# Altium schematic sheet RTL8201F.SchDoc
size A3; Author: Nguyễn Hữu Thắng; DrawnBy: Nguyễn Hữu Thắng; SheetNumber: 31; SheetTotal: 35
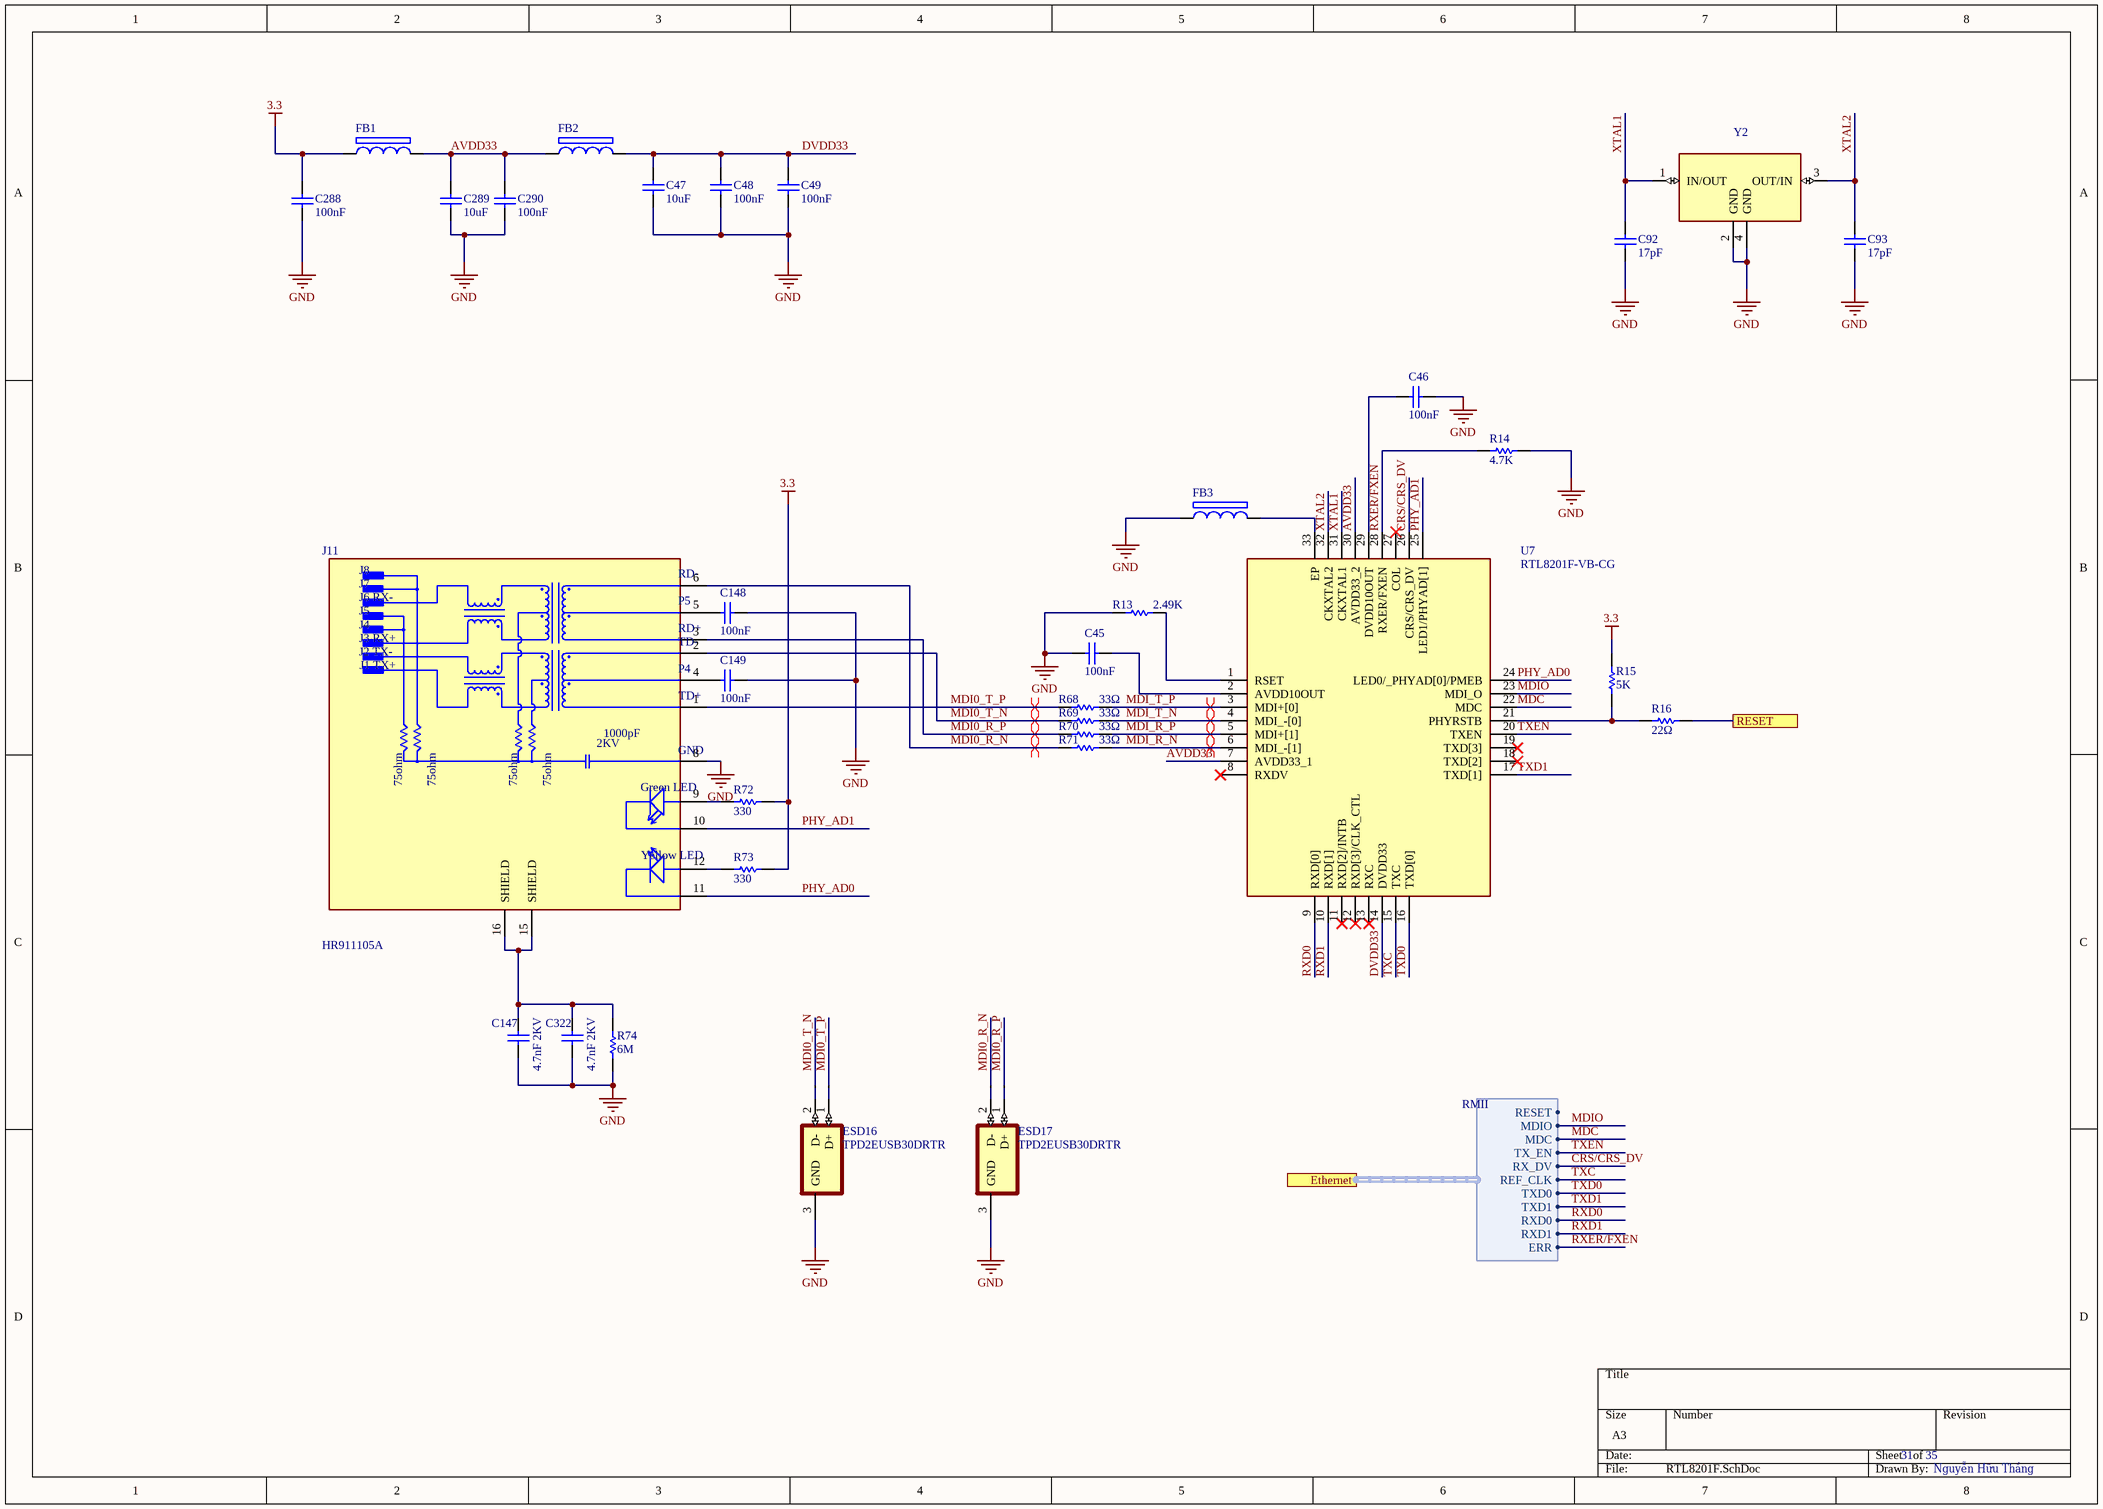
[diagram p0: RTL8201F.SchDoc]

## Parts
.10  P  [P]  (value not drawn)
.12  P  [P]  (value not drawn)
.15  P  [P]  (value not drawn)
.16  P  [P]  (value not drawn)
C45  value 100nF  [C0603]  (hidden comment: C0603)
C46  value 100nF  [C0603]  (hidden comment: C0603)
C47  value 10uF  [C1210]  (hidden comment: C1210)
C48  value 100nF  [C0603]  (hidden comment: C0603)
C49  value 100nF  [C0603]  (hidden comment: C0603)
C92  value 17pF  [C0402]  (hidden comment: C0402)
C93  value 17pF  [C0402]  (hidden comment: C0402)
C147  value 4.7nF 2KV  [C1210]  (hidden comment: C1210)
C148  value 100nF  [C0603]  (hidden comment: C0603)
C149  value 100nF  [C0603]  (hidden comment: C0603)
C288  value 100nF  [C0603]  (hidden comment: C0603)
C289  value 10uF  [C1210]  (hidden comment: C1210)
C290  value 100nF  [C0603]  (hidden comment: C0603)
C322  value 4.7nF 2KV  [C1210]  (hidden comment: C1210)
ESD16  TPD2EUSB30DRTR  [SOTFL35P100X50-3N]
ESD17  TPD2EUSB30DRTR  [SOTFL35P100X50-3N]
FB1  BLM18KG121TN1D  [BLM18EG101TH1D]  (value not drawn)
FB2  BLM18KG121TN1D  [BLM18EG101TH1D]  (value not drawn)
FB3  BLM18KG121TN1D  [BLM18EG101TH1D]  (value not drawn)
J11  HR911105A  [HANRUN_HR911105A]
R13  value 2.49K  [R0603]  (hidden comment: R0603)
R14  value 4.7K  [R0603]  (hidden comment: R0603)
R15  value 5K  [R0603]  (hidden comment: R0603)
R16  value 22Ω  [R0603]  (hidden comment: R0603)
R68  value 33Ω  [R0603]  (hidden comment: R0603)
R69  value 33Ω  [R0603]  (hidden comment: R0603)
R70  value 33Ω  [R0603]  (hidden comment: R0603)
R71  value 33Ω  [R0603]  (hidden comment: R0603)
R72  value 330  [R0603]  (hidden comment: R0603)
R73  value 330  [R0603]  (hidden comment: R0603)
R74  value 6M  [R0603]  (hidden comment: R0603)
U7  RTL8201F-VB-CG  [RTL8201F]
Y2  LGE25.000M  [XTAL_ECS-250-6-33B2-CTN-TR3]  (value not drawn)

## Ports
Ethernet (harness RMII, see main[7600,8000], MT8365[6000,9000], MT8365_CONN[13494.004,8500]), RESET (see main[8200,8000], Control_Interface[4100,4800], Power[11300,7100], UART[1500,3000])

## Harnesses
RMII: MDIO, MDC, TX_EN, RX_DV, REF_CLK, TXD0, TXD1, RXD0, RXD1, RESET, ERR

## Nets
3.3: C288.2 FB1.1 R15.2 R72.2 R73.2
GND: C45.2 C46.1 C47.1 C48.1 C49.1 C92.1 C93.1 C147.1 C148.1 C149.1 C288.1 C289.1 C290.1 C322.1 ESD16.3(GND) ESD17.3(GND) FB3.1 J11.8(GND) R13.1 R14.2 R74.2 Y2.2(GND) Y2.4(GND)
AVDD33: C289.2 C290.2 FB1.2 FB2.1 U7.7(AVDD33_1) U7.30(AVDD33_2)
CRS/CRS_DV: U7.26(CRS/CRS_DV) ; port Ethernet.RX_DV
DVDD33: C47.2 C48.2 C49.2 FB2.2 U7.14(DVDD33)
MDC: U7.22(MDC) ; port Ethernet.MDC
MDI0_R_N: .15.2 J11.6(RD-) R71.1
MDI0_R_P: .16.2 J11.3(RD+) R70.1
MDI0_T_N: .10.2 J11.2(TD-) R69.1
MDI0_T_P: .12.2 J11.1(TD+) R68.1
MDI_R_N: R71.2 U7.6(MDI_-[1])
MDI_R_P: R70.2 U7.5(MDI+[1])
MDI_T_N: R69.2 U7.4(MDI_-[0])
MDI_T_P: R68.2 U7.3(MDI+[0])
MDIO: U7.23(MDI_O) ; port Ethernet.MDIO
PHY_AD0: J11.11(YC) U7.24(LED0/_PHYAD[0]/PMEB)
PHY_AD1: J11.10(GC) U7.25(LED1/PHYAD[1])
RESET: R16.2 ; port RESET
RXD0: U7.9(RXD[0]) ; port Ethernet.RXD0
RXD1: U7.10(RXD[1]) ; port Ethernet.RXD1
RXER/FXEN: R14.1 U7.28(RXER/FXEN) ; port Ethernet.ERR
TXC: U7.15(TXC) ; port Ethernet.REF_CLK
TXD0: U7.16(TXD[0]) ; port Ethernet.TXD0
TXD1: U7.17(TXD[1]) ; port Ethernet.TXD1
TXEN: U7.20(TXEN) ; port Ethernet.TX_EN
XTAL1: C92.2 U7.31(CKXTAL1) Y2.1(IN/OUT)
XTAL2: C93.2 U7.32(CKXTAL2) Y2.3(OUT/IN)
Net.10_1: .10.1 ESD16.2(D-)
Net.12_1: .12.1 ESD16.1(D+)
Net.15_1: .15.1 ESD17.2(D-)
Net.16_1: .16.1 ESD17.1(D+)
NetC45_1: C45.1 U7.2(AVDD10OUT)
NetC46_2: C46.2 U7.29(DVDD10OUT)
NetC147_2: C147.2 C322.2 J11.15(SHIELD) J11.16(SHIELD) R74.1
NetC148_2: C148.2 J11.5(P5)
NetC149_2: C149.2 J11.4(P4)
NetFB3_2: FB3.2 U7.33(EP)
NetJ11_9: J11.9(GA) R72.1
NetJ11_12: J11.12(YA) R73.1
NetR13_2: R13.2 U7.1(RSET)
NetR15_1: R15.1 R16.1 U7.21(PHYRSTB)

Not connected (* = marked no-connect by the designer): U7 8(RXDV)* 11(RXD[2]/INTB)* 12(RXD[3]/CLK_CTL)* 13(RXC)* 18(TXD[2])* 19(TXD[3])* 27(COL)*

## Layout directives
differential pair: MDI0_R_N, MDI0_R_P, MDI0_T_N, MDI0_T_P, MDI_R_N, MDI_R_P, MDI_T_N, MDI_T_P

## Notes on the sheet
- (in symbol HR911105A) J8; J7; J6 RX-; J5; J4; J3 RX+; J2 TX-; J1 TX+; 1000pF; 75ohm; 2KV; Green LED; Yellow LED

## Library data of the parts
C92 C93 = C0402: nên chọn tụ từ 14 đến 20 với LGE25.000M
ESD16 ESD17 = TPD2EUSB30DRTR: 2-channel ESD solution for SuperSpeed USB 3.0 interface 3-SOT-9X3 -40 to 85
FB1-FB3 = BLM18KG121TN1D: Ferrite Bead. 0603. 3A.  DC Resistance(DCR) 30mΩ. 120Ω@100MHz; Manufacturer_Name: Murata Electronics; Datasheet Link: http://www.murata.com/~/media/webrenewal/support/library/catalog/products/emc/emifil/c31e.ashx?la=en-gb; Height: 0.75mm; Manufacturer_Part_Number: BLM18KG121TN1D; Mouser Part Number: 81-BLM18KG121TN1D; Mouser Price/Stock: https://www.mouser.co.uk/ProductDetail/Murata-Electronics/BLM18KG121TN1D?qs=rvfpa0%252BU10PYAwVv0fw24Q%3D%3D; Arrow Part Number: BLM18KG121TN1D; Arrow Price/Stock: https://www.arrow.com/en/products/blm18kg121tn1d/murata-manufacturing?utm_currency=USD&region=nac
J11 = HR911105A: RJ45 có biến áp
U7 = RTL8201F-VB-CG: Integrated Circuit; Manufacturer_Name: Realtek; Datasheet Link: https://pdf1.alldatasheet.com/datasheet-pdf/view/1132250/REALTEK/RTL8201F-VB-CG.html; Height: 1mm; Manufacturer_Part_Number: RTL8201F-VB-CG
Y2 = LGE25.000M: Crystals 25.0000MHZ 12pF SMD 30Ω